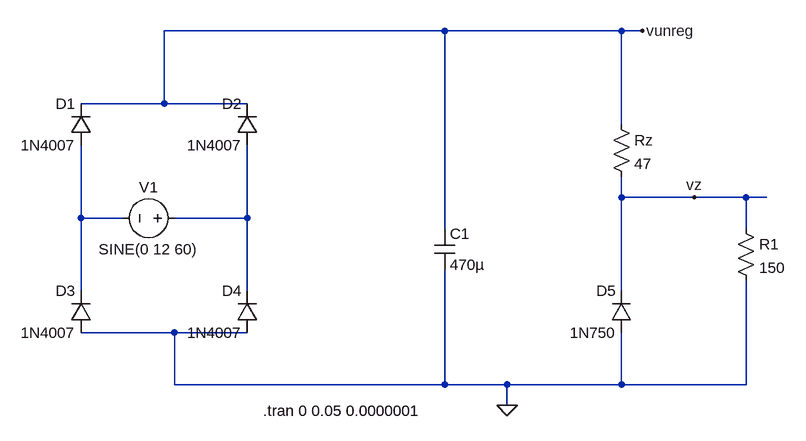
[diagram p0: schematic zener_diode.asc]
zener_diode.asc, the LTspice schematic file:
Version 4.1
SHEET 1 1028 680
WIRE 496 -80 64 -80
WIRE 768 -80 496 -80
WIRE 800 -80 768 -80
WIRE 64 32 64 -80
WIRE 64 32 -64 32
WIRE 192 32 64 32
WIRE 768 64 768 -80
WIRE 768 176 768 144
WIRE 880 176 768 176
WIRE 960 176 880 176
WIRE 992 176 960 176
WIRE -64 208 -64 96
WIRE 0 208 -64 208
WIRE 192 208 192 96
WIRE 192 208 80 208
WIRE 496 224 496 -80
WIRE 960 224 960 176
WIRE -64 320 -64 208
WIRE 192 320 192 208
WIRE 768 320 768 176
WIRE 80 384 -64 384
WIRE 192 384 80 384
WIRE 80 464 80 384
WIRE 496 464 496 288
WIRE 496 464 80 464
WIRE 592 464 496 464
WIRE 768 464 768 384
WIRE 768 464 592 464
WIRE 960 464 960 304
WIRE 960 464 768 464
WIRE 592 496 592 464
FLAG 800 -80 vunreg
FLAG 880 176 vz
FLAG 592 496 0
SYMBOL voltage 96 208 R90
WINDOW 0 -32 56 VBottom 2
WINDOW 3 32 56 VTop 2
WINDOW 123 0 0 Left 0
WINDOW 39 0 0 Left 0
SYMATTR InstName V1
SYMATTR Value SINE(0 12 60)
SYMBOL cap 480 224 R0
SYMATTR InstName C1
SYMATTR Value 470µ
SYMBOL res 752 48 R0
SYMATTR InstName Rz
SYMATTR Value 47
SYMBOL res 944 208 R0
SYMATTR InstName R1
SYMATTR Value 150
SYMBOL diode -48 96 R180
WINDOW 0 24 64 Left 2
WINDOW 3 24 0 Left 2
SYMATTR InstName D1
SYMATTR Value 1N4007
SYMBOL diode 208 96 R180
WINDOW 0 24 64 Left 2
WINDOW 3 24 0 Left 2
SYMATTR InstName D2
SYMATTR Value 1N4007
SYMBOL diode -48 384 R180
WINDOW 0 24 64 Left 2
WINDOW 3 24 0 Left 2
SYMATTR InstName D3
SYMATTR Value 1N4007
SYMBOL diode 208 384 R180
WINDOW 0 24 64 Left 2
WINDOW 3 24 0 Left 2
SYMATTR InstName D4
SYMATTR Value 1N4007
SYMBOL diode 784 384 R180
WINDOW 0 24 64 Left 2
WINDOW 3 24 0 Left 2
SYMATTR InstName D5
SYMATTR Value 1N750
TEXT 216 504 Left 2 !.tran 0 0.05 0.0000001

The netlist it stands for:
* zener_diode.asc
V1 N002 N001 SINE(0 12 60)
C1 vunreg 0 470µ
Rz vunreg vz 47
R1 vz 0 150
D1 N001 vunreg 1N4007
D2 N002 vunreg 1N4007
D3 0 N001 1N4007
D4 0 N002 1N4007
D5 0 vz 1N750
.model D D
.lib standard.dio
.tran 0 0.05 0.0000001
.backanno
.end